# EAGLE design LE1-11 (EAGLE 8.5.2)
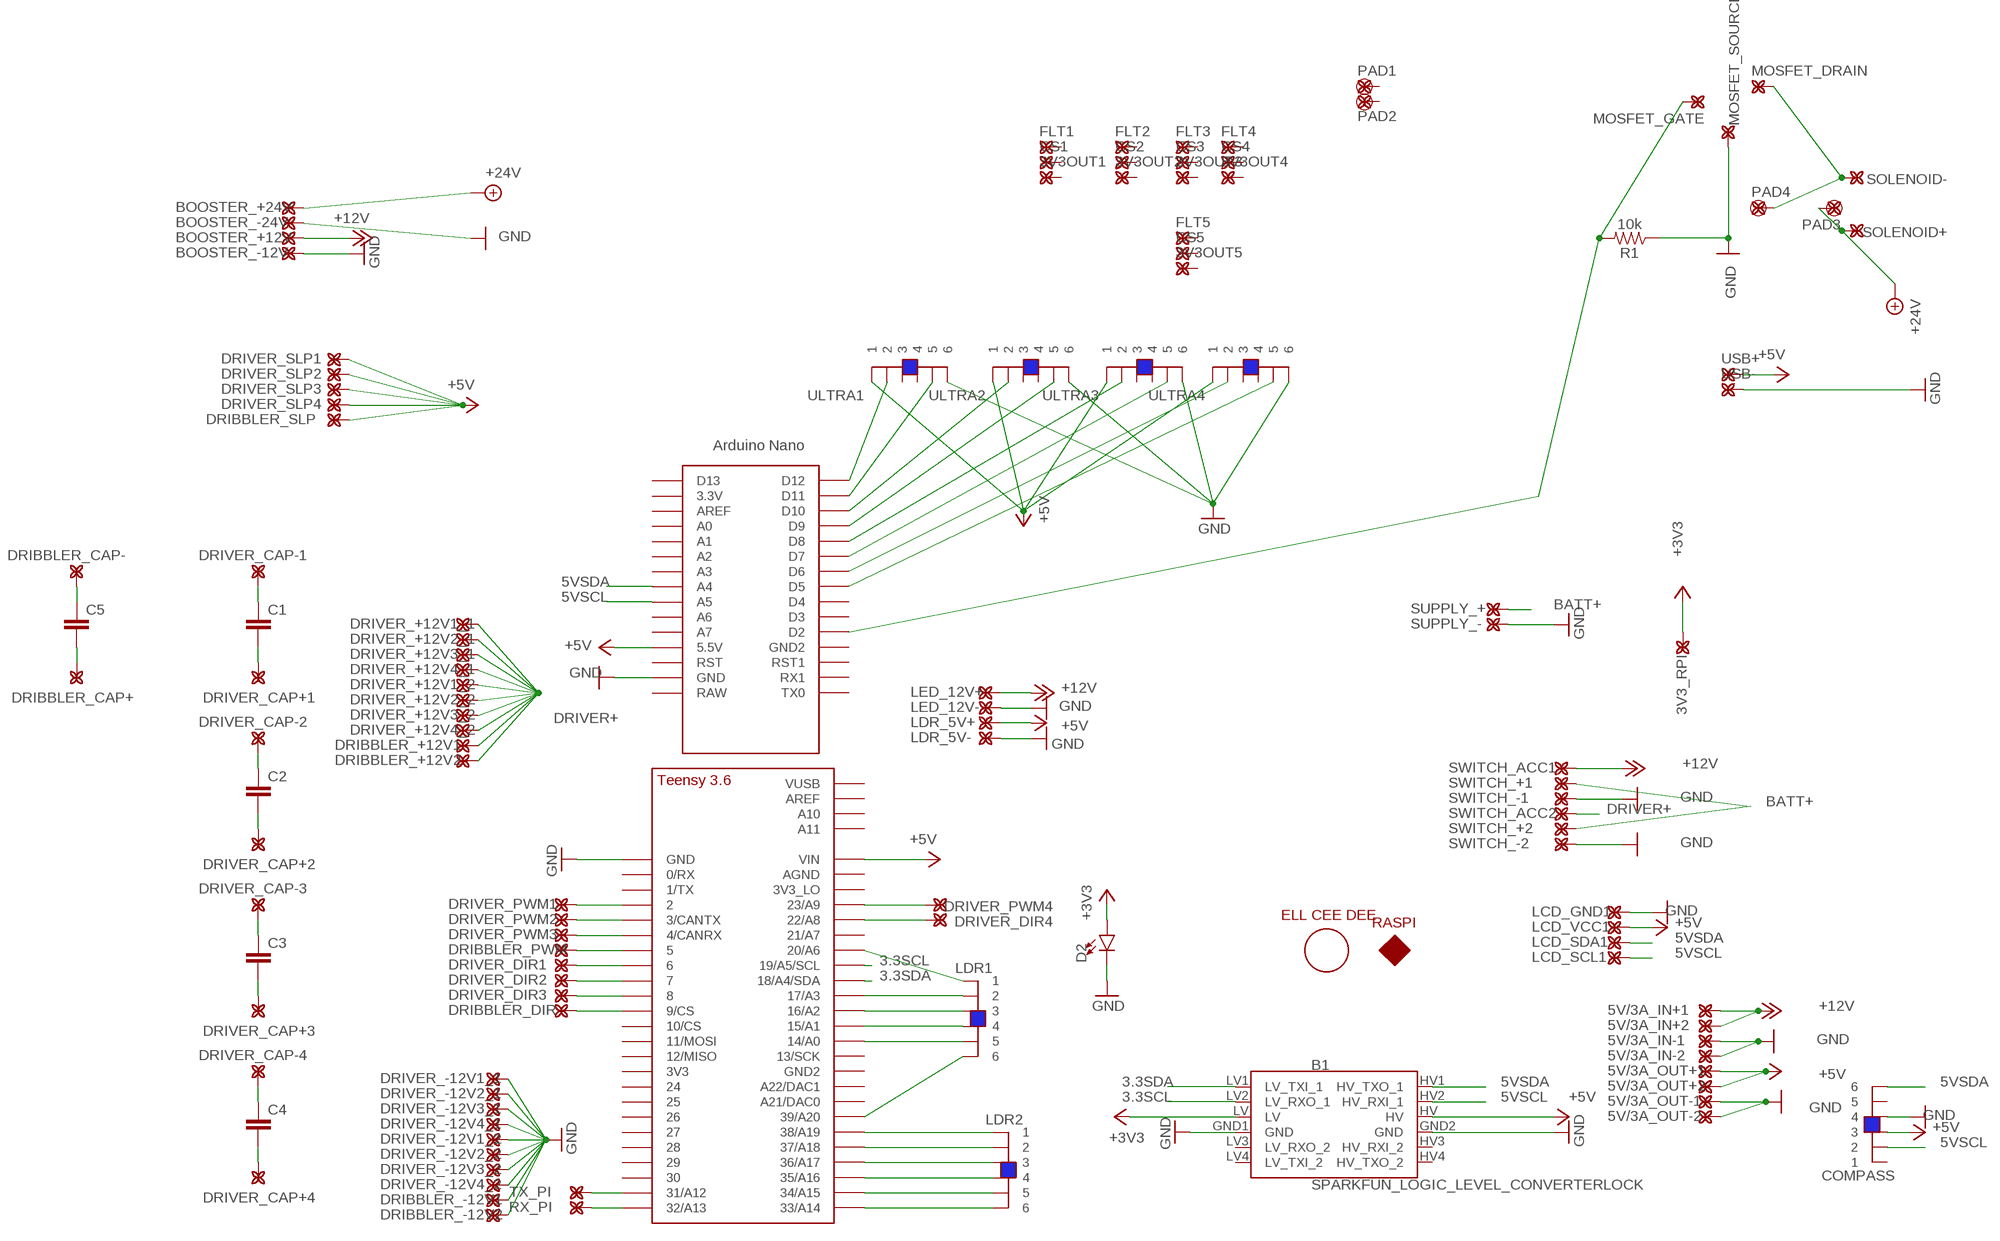
[diagram p0: schematic, sheet 1]

## Parts
3V3_RPI  BETTERPAD_2.54  [SUPERIORSIM]
3V3OUT1  BETTERPAD_2.54  [SUPERIORSIM]
3V3OUT2  BETTERPAD_2.54  [SUPERIORSIM]
3V3OUT3  BETTERPAD_2.54  [SUPERIORSIM]
3V3OUT4  BETTERPAD_2.54  [SUPERIORSIM]
3V3OUT5  BETTERPAD_2.54  [SUPERIORSIM]
5V/3A_IN+1  BETTERPAD_2.54  [SUPERIORSIM]
5V/3A_IN+2  BETTERPAD_2.54  [SUPERIORSIM]
5V/3A_IN-1  BETTERPAD_2.54  [SUPERIORSIM]
5V/3A_IN-2  BETTERPAD_2.54  [SUPERIORSIM]
5V/3A_OUT+1  BETTERPAD_2.54  [SUPERIORSIM]
5V/3A_OUT+2  BETTERPAD_2.54  [SUPERIORSIM]
5V/3A_OUT-1  BETTERPAD_2.54  [SUPERIORSIM]
5V/3A_OUT-2  BETTERPAD_2.54  [SUPERIORSIM]
B1  SPARKFUN_LOGIC_LEVEL_CONVERTERLOCK  [SPARKFUN_LOGIC_LEVEL_CONVERTER_LOCK]
BOOSTER_+12V  BETTERPAD_2.54  [SUPERIORSIM]
BOOSTER_+24V  BETTERPAD_2.54  [SUPERIORSIM]
BOOSTER_-12V  BETTERPAD_2.54  [SUPERIORSIM]
BOOSTER_-24V  BETTERPAD_2.54  [SUPERIORSIM]
C1  C5/7.2  [C5B7.2]
C2  C5/7.2  [C5B7.2]
C3  C5/7.2  [C5B7.2]
C4  C5/7.2  [C5B7.2]
C5  C5/7.2  [C5B7.2]
COMPASS  6P6C_FEMALESMD  [6P6C_FEMALE]
CS1  BETTERPAD_2.54  [SUPERIORSIM]
CS2  BETTERPAD_2.54  [SUPERIORSIM]
CS3  BETTERPAD_2.54  [SUPERIORSIM]
CS4  BETTERPAD_2.54  [SUPERIORSIM]
CS5  BETTERPAD_2.54  [SUPERIORSIM]
D2  LED-3MM-NO_SILK  [LED_3MM-NS]
DRIBBLER_+12V1  BETTERPAD_2.54  [SUPERIORSIM]
DRIBBLER_+12V2  BETTERPAD_2.54  [SUPERIORSIM]
DRIBBLER_-12V1  BETTERPAD_2.54  [SUPERIORSIM]
DRIBBLER_-12V2  BETTERPAD_2.54  [SUPERIORSIM]
DRIBBLER_CAP+  BETTERPAD_2.54  [SUPERIORSIM]
DRIBBLER_CAP-  BETTERPAD_2.54  [SUPERIORSIM]
DRIBBLER_DIR  BETTERPAD_2.54  [SUPERIORSIM]
DRIBBLER_PWM  BETTERPAD_2.54  [SUPERIORSIM]
DRIBBLER_SLP  BETTERPAD_2.54  [SUPERIORSIM]
DRIVER_+12V1_1  BETTERPAD_2.54  [SUPERIORSIM]
DRIVER_+12V1_2  BETTERPAD_2.54  [SUPERIORSIM]
DRIVER_+12V2_1  BETTERPAD_2.54  [SUPERIORSIM]
DRIVER_+12V2_2  BETTERPAD_2.54  [SUPERIORSIM]
DRIVER_+12V3_1  BETTERPAD_2.54  [SUPERIORSIM]
DRIVER_+12V3_2  BETTERPAD_2.54  [SUPERIORSIM]
DRIVER_+12V4_1  BETTERPAD_2.54  [SUPERIORSIM]
DRIVER_+12V4_2  BETTERPAD_2.54  [SUPERIORSIM]
DRIVER_-12V1_1  BETTERPAD_2.54  [SUPERIORSIM]
DRIVER_-12V1_2  BETTERPAD_2.54  [SUPERIORSIM]
DRIVER_-12V2_1  BETTERPAD_2.54  [SUPERIORSIM]
DRIVER_-12V2_2  BETTERPAD_2.54  [SUPERIORSIM]
DRIVER_-12V3_1  BETTERPAD_2.54  [SUPERIORSIM]
DRIVER_-12V3_2  BETTERPAD_2.54  [SUPERIORSIM]
DRIVER_-12V4_1  BETTERPAD_2.54  [SUPERIORSIM]
DRIVER_-12V4_2  BETTERPAD_2.54  [SUPERIORSIM]
DRIVER_CAP+1  BETTERPAD_2.54  [SUPERIORSIM]
DRIVER_CAP+2  BETTERPAD_2.54  [SUPERIORSIM]
DRIVER_CAP+3  BETTERPAD_2.54  [SUPERIORSIM]
DRIVER_CAP+4  BETTERPAD_2.54  [SUPERIORSIM]
DRIVER_CAP-1  BETTERPAD_2.54  [SUPERIORSIM]
DRIVER_CAP-2  BETTERPAD_2.54  [SUPERIORSIM]
DRIVER_CAP-3  BETTERPAD_2.54  [SUPERIORSIM]
DRIVER_CAP-4  BETTERPAD_2.54  [SUPERIORSIM]
DRIVER_DIR1  BETTERPAD_2.54  [SUPERIORSIM]
DRIVER_DIR2  BETTERPAD_2.54  [SUPERIORSIM]
DRIVER_DIR3  BETTERPAD_2.54  [SUPERIORSIM]
DRIVER_DIR4  BETTERPAD_2.54  [SUPERIORSIM]
DRIVER_PWM1  BETTERPAD_2.54  [SUPERIORSIM]
DRIVER_PWM2  BETTERPAD_2.54  [SUPERIORSIM]
DRIVER_PWM3  BETTERPAD_2.54  [SUPERIORSIM]
DRIVER_PWM4  BETTERPAD_2.54  [SUPERIORSIM]
DRIVER_SLP1  BETTERPAD_2.54  [SUPERIORSIM]
DRIVER_SLP2  BETTERPAD_2.54  [SUPERIORSIM]
DRIVER_SLP3  BETTERPAD_2.54  [SUPERIORSIM]
DRIVER_SLP4  BETTERPAD_2.54  [SUPERIORSIM]
FLT1  BETTERPAD_2.54  [SUPERIORSIM]
FLT2  BETTERPAD_2.54  [SUPERIORSIM]
FLT3  BETTERPAD_2.54  [SUPERIORSIM]
FLT4  BETTERPAD_2.54  [SUPERIORSIM]
FLT5  BETTERPAD_2.54  [SUPERIORSIM]
LCD1  LCD-16X2SILK  [LCD-16X2]
LCD_GND1  BETTERPAD_2.54  [SUPERIORSIM]
LCD_SCL1  BETTERPAD_2.54  [SUPERIORSIM]
LCD_SDA1  BETTERPAD_2.54  [SUPERIORSIM]
LCD_VCC1  BETTERPAD_2.54  [SUPERIORSIM]
LDR1  6P6C_FEMALESMD  [6P6C_FEMALE]
LDR2  6P6C_FEMALESMD  [6P6C_FEMALE]
LDR_5V+  BETTERPAD_2.54  [SUPERIORSIM]
LDR_5V-  BETTERPAD_2.54  [SUPERIORSIM]
LED_12V+  BETTERPAD_2.54  [SUPERIORSIM]
LED_12V-  BETTERPAD_2.54  [SUPERIORSIM]
MOSFET_DRAIN  BETTERPAD_2.54  [SUPERIORSIM]
MOSFET_GATE  BETTERPAD_2.54  [SUPERIORSIM]
MOSFET_SOURCE  BETTERPAD_2.54  [SUPERIORSIM]
PAD1  BETTERPAD_2.54/1.5  [1,5]
PAD2  BETTERPAD_2.54/1.5  [1,5]
PAD3  BETTERPAD_2.54/1.5  [1,5]
PAD4  BETTERPAD_2.54/1.5  [1,5]
PCB1  RPI3  [RPI3]
R1  10k  10KOHM-HORIZ-1/4W-1%  [AXIAL-0.3]
RX_PI  BETTERPAD_2.54  [SUPERIORSIM]
SOLENOID+  BETTERPAD_2.54  [SUPERIORSIM]
SOLENOID-  BETTERPAD_2.54  [SUPERIORSIM]
SUPPLY_+  BETTERPAD_2.54  [SUPERIORSIM]
SUPPLY_-  BETTERPAD_2.54  [SUPERIORSIM]
SWITCH_+1  BETTERPAD_2.54  [SUPERIORSIM]
SWITCH_+2  BETTERPAD_2.54  [SUPERIORSIM]
SWITCH_-1  BETTERPAD_2.54  [SUPERIORSIM]
SWITCH_-2  BETTERPAD_2.54  [SUPERIORSIM]
SWITCH_ACC1  BETTERPAD_2.54  [SUPERIORSIM]
SWITCH_ACC2  BETTERPAD_2.54  [SUPERIORSIM]
TX_PI  BETTERPAD_2.54  [SUPERIORSIM]
U$1  TEENSY_3.5/3.6_BASIC  [TEENSY_3.5/3.6_BASIC]
U$2  NANO  [NANO]
ULTRA1  6P6C_FEMALESMD  [6P6C_FEMALE]
ULTRA2  6P6C_FEMALESMD  [6P6C_FEMALE]
ULTRA3  6P6C_FEMALESMD  [6P6C_FEMALE]
ULTRA4  6P6C_FEMALESMD  [6P6C_FEMALE]
USB+  BETTERPAD_2.54  [SUPERIORSIM]
USB-  BETTERPAD_2.54  [SUPERIORSIM]

## Nets
3.3SCL: B1.LV2(LV_RXO_1) U$1.19/A5/SCL
3.3SDA: B1.LV1(LV_TXI_1) U$1.18/A4/SDA
5VSCL: B1.HV2(HV_RXI_1) COMPASS.2 LCD_SCL1..(P) U$2.A5
5VSDA: B1.HV1(HV_TXO_1) COMPASS.6 LCD_SDA1..(P) U$2.A4
+3V3: 3V3_RPI..(P) B1.LV D2.A
+5V: 5V/3A_OUT+1..(P) 5V/3A_OUT+2..(P) B1.HV COMPASS.3 DRIBBLER_SLP..(P) DRIVER_SLP1..(P) DRIVER_SLP2..(P) DRIVER_SLP3..(P) DRIVER_SLP4..(P) LCD_VCC1..(P) LDR_5V+..(P) U$1.VIN U$2.5V(5.5V) ULTRA1.1 ULTRA2.1 ULTRA3.1 ULTRA4.1 USB+..(P)
+12V: 5V/3A_IN+1..(P) 5V/3A_IN+2..(P) BOOSTER_+12V..(P) LED_12V+..(P) SWITCH_ACC1..(P)
+24V: BOOSTER_+24V..(P) PAD3.P$1(P) SOLENOID+..(P)
BATT+: SUPPLY_+..(P) SWITCH_+1..(P) SWITCH_+2..(P)
DRIVER+: DRIBBLER_+12V1..(P) DRIBBLER_+12V2..(P) DRIVER_+12V1_1..(P) DRIVER_+12V1_2..(P) DRIVER_+12V2_1..(P) DRIVER_+12V2_2..(P) DRIVER_+12V3_1..(P) DRIVER_+12V3_2..(P) DRIVER_+12V4_1..(P) DRIVER_+12V4_2..(P) SWITCH_ACC2..(P)
GND: 5V/3A_IN-1..(P) 5V/3A_IN-2..(P) 5V/3A_OUT-1..(P) 5V/3A_OUT-2..(P) B1.GND1(GND) B1.GND2(GND) BOOSTER_-12V..(P) BOOSTER_-24V..(P) COMPASS.4 D2.K(C) DRIBBLER_-12V1..(P) DRIBBLER_-12V2..(P) DRIVER_-12V1_1..(P) DRIVER_-12V1_2..(P) DRIVER_-12V2_1..(P) DRIVER_-12V2_2..(P) DRIVER_-12V3_1..(P) DRIVER_-12V3_2..(P) DRIVER_-12V4_1..(P) DRIVER_-12V4_2..(P) LCD_GND1..(P) LDR_5V-..(P) LED_12V-..(P) MOSFET_SOURCE..(P) R1.P$1 SUPPLY_-..(P) SWITCH_-1..(P) SWITCH_-2..(P) U$1.GND U$2.GND ULTRA1.6 ULTRA2.6 ULTRA3.6 ULTRA4.6 USB-..(P)
N$1: LDR1.6 U$1.39/A20
N$2: TX_PI..(P) U$1.31/A12
N$3: RX_PI..(P) U$1.32/A13
N$4: DRIBBLER_DIR..(P) U$1.9/CS
N$5: DRIVER_DIR3..(P) U$1.8
N$6: LDR1.5 U$1.14/A0
N$7: LDR1.4 U$1.15/A1
N$8: LDR1.3 U$1.16/A2
N$9: LDR1.2 U$1.17/A3
N$10: LDR1.1 U$1.20/A6
N$11: DRIVER_DIR2..(P) U$1.7
N$12: MOSFET_DRAIN..(P) PAD4.P$1(P) SOLENOID-..(P)
N$14: DRIVER_PWM4..(P) U$1.23/A9
N$15: DRIVER_DIR4..(P) U$1.22/A8
N$16: C4.2 DRIVER_CAP+4..(P)
N$17: DRIVER_DIR1..(P) U$1.6
N$18: LDR2.1 U$1.38/A19
N$19: LDR2.2 U$1.37/A18
N$20: LDR2.3 U$1.36/A17
N$21: LDR2.4 U$1.35/A16
N$22: LDR2.5 U$1.34/A15
N$23: LDR2.6 U$1.33/A14
N$24: DRIBBLER_PWM..(P) U$1.5
N$25: DRIVER_PWM3..(P) U$1.4/CANRX
N$26: U$2.D12 ULTRA1.2
N$27: C4.1 DRIVER_CAP-4..(P)
N$28: U$2.D11 ULTRA1.5
N$29: U$2.D10 ULTRA2.2
N$30: U$2.D9 ULTRA2.5
N$31: C3.2 DRIVER_CAP+3..(P)
N$32: C3.1 DRIVER_CAP-3..(P)
N$33: C2.2 DRIVER_CAP+2..(P)
N$34: C2.1 DRIVER_CAP-2..(P)
N$35: C1.2 DRIVER_CAP+1..(P)
N$36: C1.1 DRIVER_CAP-1..(P)
N$37: C5.1 DRIBBLER_CAP-..(P)
N$38: C5.2 DRIBBLER_CAP+..(P)
N$39: U$2.D8 ULTRA3.2
N$40: U$2.D7 ULTRA3.5
N$41: U$2.D6 ULTRA4.2
N$42: U$2.D5 ULTRA4.5
N$43: DRIVER_PWM2..(P) U$1.3/CANTX
N$44: DRIVER_PWM1..(P) U$1.2
N$45: MOSFET_GATE..(P) R1.P$2 U$2.D2
Unconnected: 3V3OUT1..(P) 3V3OUT2..(P) 3V3OUT3..(P) 3V3OUT4..(P) 3V3OUT5..(P) B1.HV3(HV_RXI_2) B1.HV4(HV_TXO_2) B1.LV3(LV_RXO_2) B1.LV4(LV_TXI_2) COMPASS.1 COMPASS.5 CS1..(P) CS2..(P) CS3..(P) CS4..(P) CS5..(P) FLT1..(P) FLT2..(P) FLT3..(P) FLT4..(P) FLT5..(P) PAD1.P$1(P) PAD2.P$1(P) U$1.0/RX U$1.1/TX U$1.3V3 U$1.3V3_LO U$1.10/CS U$1.11/MOSI U$1.12/MISO U$1.13/SCK U$1.21/A7 U$1.21/DAC0(A21/DAC0) U$1.24 U$1.25 U$1.26 U$1.27 U$1.28 U$1.29 U$1.30 U$1.A10 U$1.A11 U$1.A22/DAC1 U$1.AGND U$1.AREF U$1.GND2 U$1.VUSB U$2.3.3V U$2.A0 U$2.A1 U$2.A2 U$2.A3 U$2.A6 U$2.A7 U$2.AREF U$2.D3 U$2.D4 U$2.D13 U$2.GND1(GND2) U$2.RAW U$2.RST U$2.RST1 U$2.RX1 U$2.TX0 ULTRA1.3 ULTRA1.4 ULTRA2.3 ULTRA2.4 ULTRA3.3 ULTRA3.4 ULTRA4.3 ULTRA4.4

## Library data of the parts
3V3_RPI 3V3OUT1-3V3OUT5 5V/3A_IN+1 5V/3A_IN+2 5V/3A_IN-1 5V/3A_IN-2 5V/3A_OUT+1 5V/3A_OUT+2 5V/3A_OUT-1 5V/3A_OUT-2 BOOSTER_+12V BOOSTER_+24V BOOSTER_-12V BOOSTER_-24V CS1-CS5 DRIBBLER_+12V1 DRIBBLER_+12V2 DRIBBLER_-12V1 DRIBBLER_-12V2 DRIBBLER_CAP+ DRIBBLER_CAP- DRIBBLER_DIR DRIBBLER_PWM DRIBBLER_SLP DRIVER_+12V1_1 DRIVER_+12V1_2 DRIVER_+12V2_1 DRIVER_+12V2_2 DRIVER_+12V3_1 DRIVER_+12V3_2 DRIVER_+12V4_1 DRIVER_+12V4_2 DRIVER_-12V1_1 DRIVER_-12V1_2 DRIVER_-12V2_1 DRIVER_-12V2_2 DRIVER_-12V3_1 DRIVER_-12V3_2 DRIVER_-12V4_1 DRIVER_-12V4_2 DRIVER_CAP+1-DRIVER_CAP+4 DRIVER_CAP-1-DRIVER_CAP-4 DRIVER_DIR1-DRIVER_DIR4 DRIVER_PWM1-DRIVER_PWM4 DRIVER_SLP1-DRIVER_SLP4 FLT1-FLT5 LCD_GND1 LCD_SCL1 LCD_SDA1 LCD_VCC1 LDR_5V+ LDR_5V- LED_12V+ LED_12V- MOSFET_DRAIN MOSFET_GATE MOSFET_SOURCE RX_PI SOLENOID+ SOLENOID- SUPPLY_+ SUPPLY_- SWITCH_+1 SWITCH_+2 SWITCH_-1 SWITCH_-2 SWITCH_ACC1 SWITCH_ACC2 TX_PI USB+ USB- = Yijiano:BETTERPAD_2.54
B1 = SparkFun-Boards:SPARKFUN_LOGIC_LEVEL_CONVERTER: SparkFun Logic Level Converter -Bi-Directional This is the mechnical outline for the 3.3V - 5V bi directional logic level converter. *Note, the "LOCK" Package has the header pins staggered by an offset of 5 mils (off center line), so that when you slide a row of standard 0.1" headers into the PTH pads, it will hold position vertically. See the follwing turorial for more information on this type of special footprints: Sneaky Footprints <https://www.sparkfun.com/tutorials/114> SparkFun Products: SparkFun Logic Level Converter - Bi-Directional <https://www.sparkfun.com/products/12009>
C1-C5 = capacitor-wima:C: CAPACITOR naming: grid - package width
COMPASS LDR1 LDR2 ULTRA1-ULTRA4 = Yijiano:6P6C_FEMALE
D2 = SparkFun-LED:LED: LED (Generic) Standard schematic elements and footprints for 5mm, 3mm, 1206, and 0603 sized LEDs. Generic LEDs with no color specified.
LCD1 = SparkFun-Displays:LCD-16X2: Standard text-only 16x2 parallel input LCD Basic 16 character by 2 line display. Typically utilizes the extremely common HD44780 parallel interface chipset SparkFun Products: Basic 16x2 Green <https://www.sparkfun.com/products/255> Basic 8x2 Green <https://www.sparkfun.com/products/11122>; SF_ID: LCD-00255
PAD1-PAD4 = Yijiano:BETTERPAD_2.54/1.5
PCB1 = e14_Rpi3_RevA:RPI3: Device for Raspberry Pi 3 board created by Dave Young for www.element14.com More information and support community is available at https://www.element14.com/community/community/raspberry-pi
R1 = SparkFun-Resistors:10KOHM: 10kΩ resistor A resistor is a passive two-terminal electrical component that implements electrical resistance as a circuit element. Resistors act to reduce current flow, and, at the same time, act to lower voltage levels within circuits. - Wikipedia; PROD_ID: RES-12183
U$1 = Teensy356:TEENSY_3.5/3.6_BASIC
U$2 = Arduino-clone:NANO: Arduino Nano

## Board
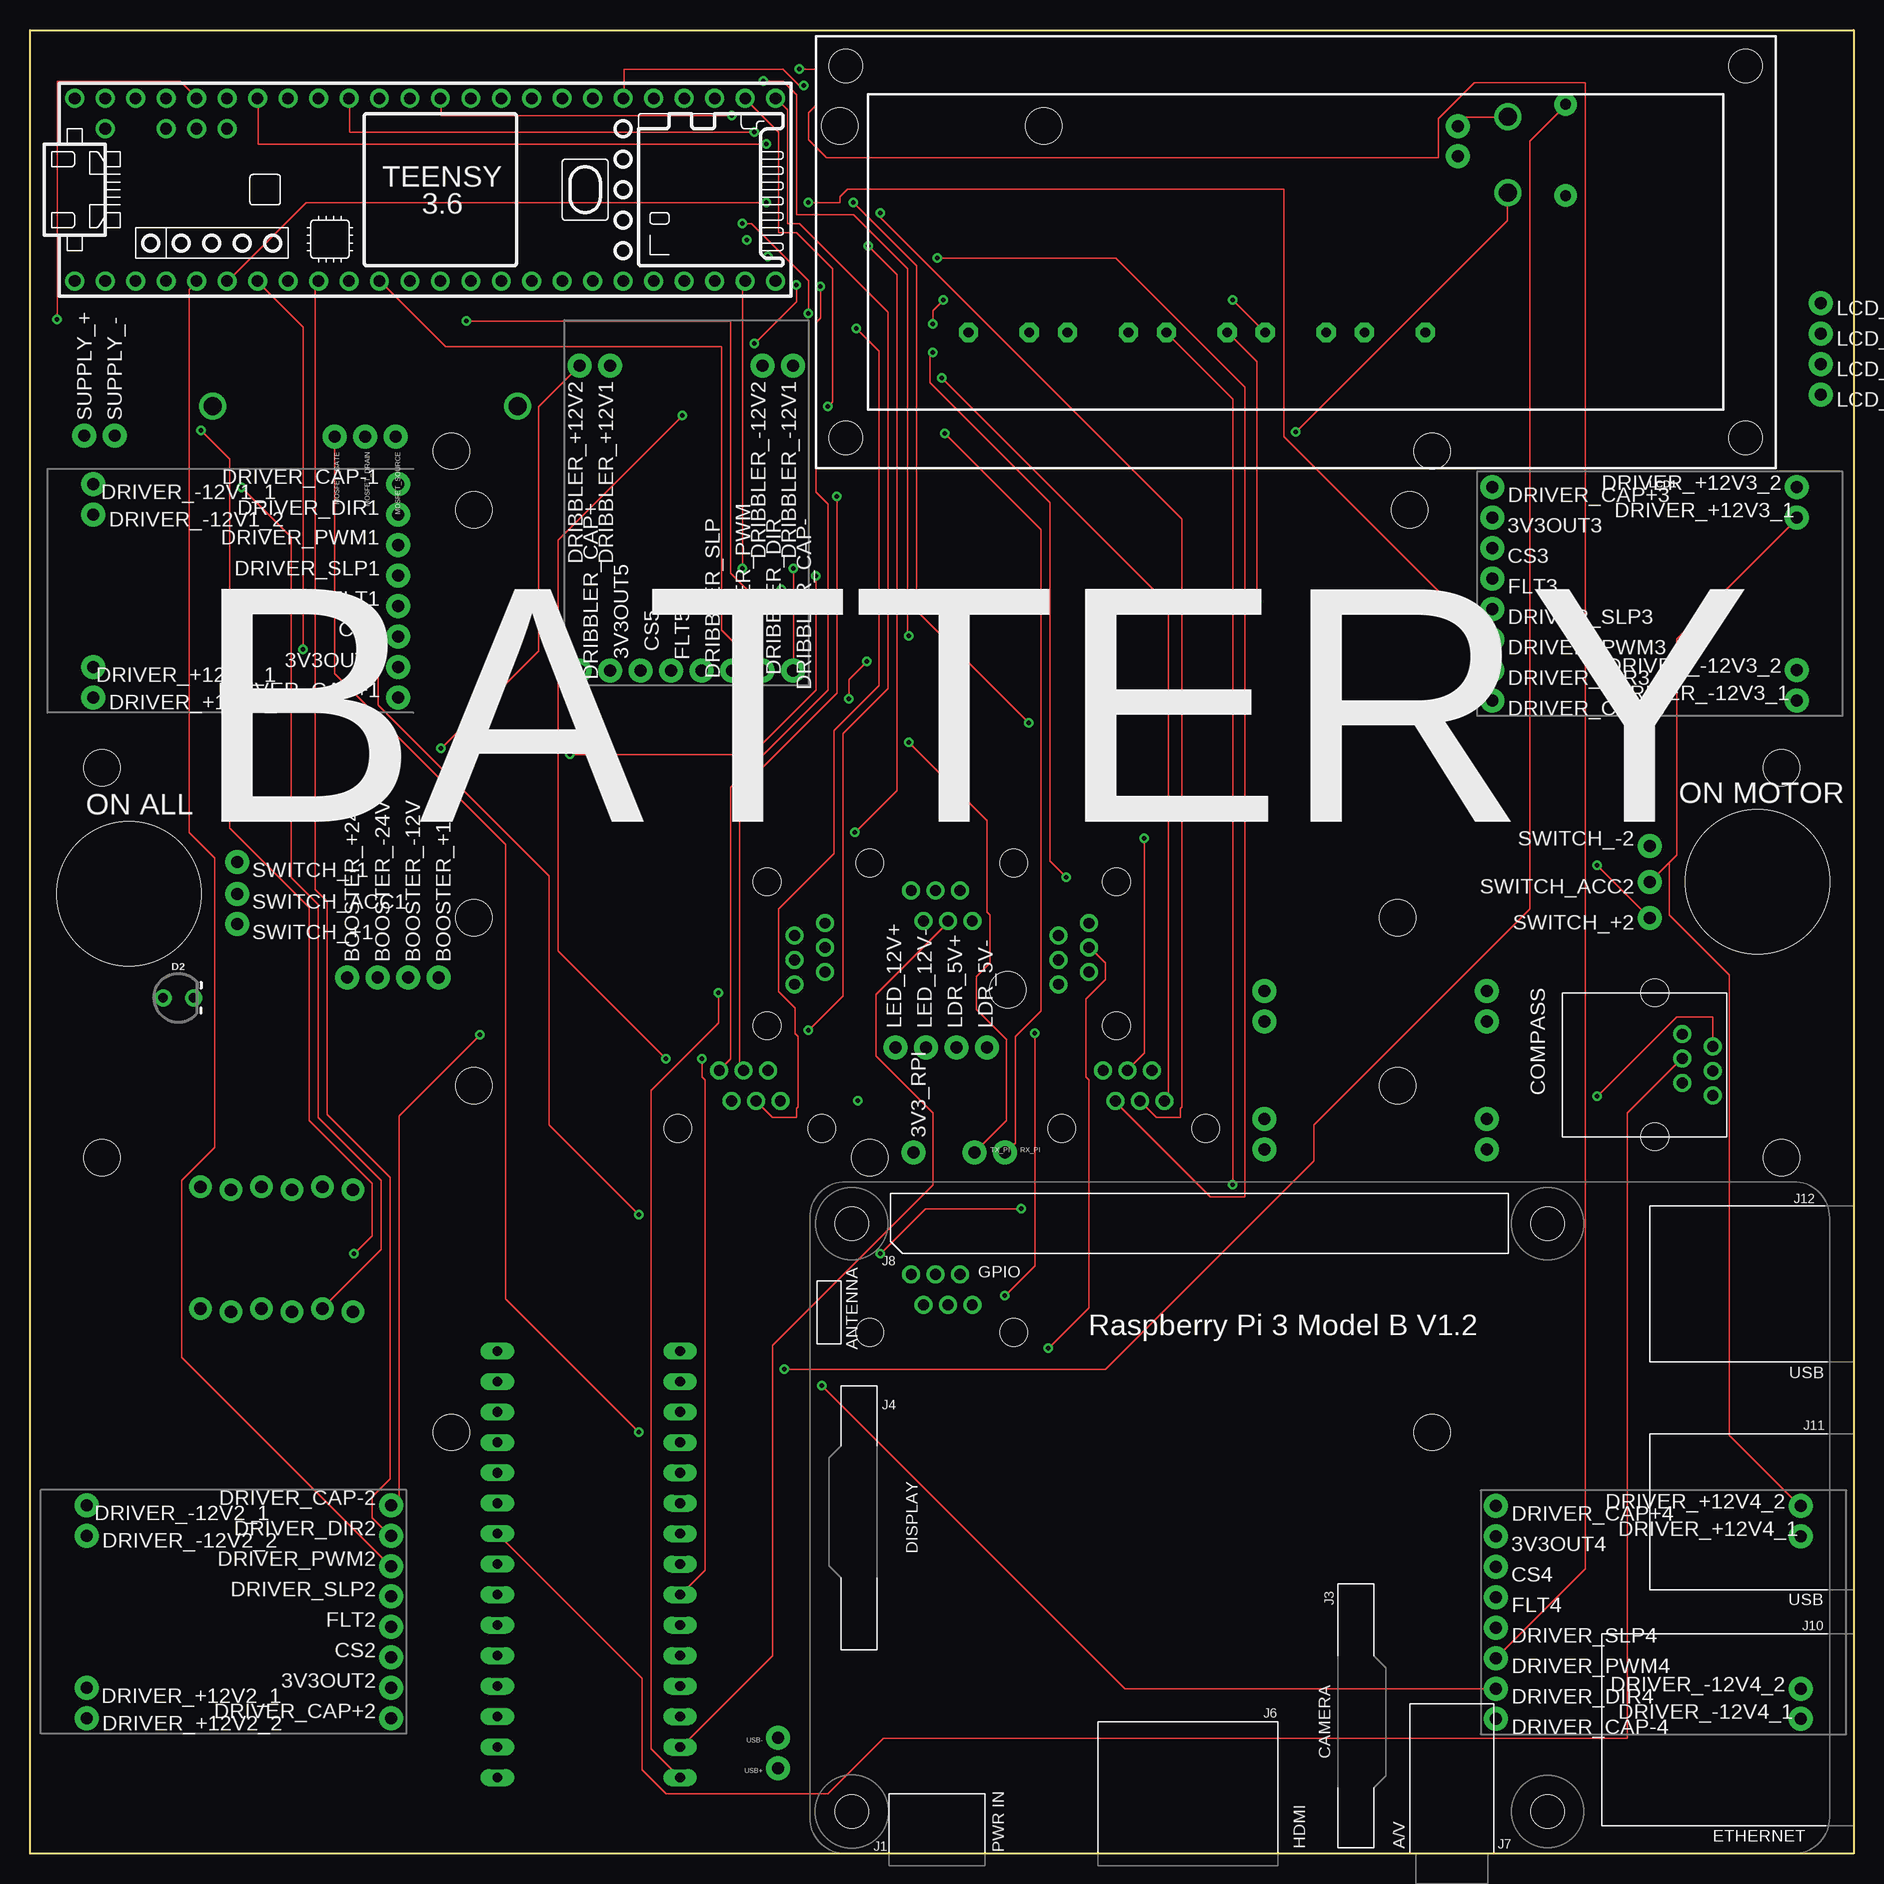
[diagram p1: board, top side]
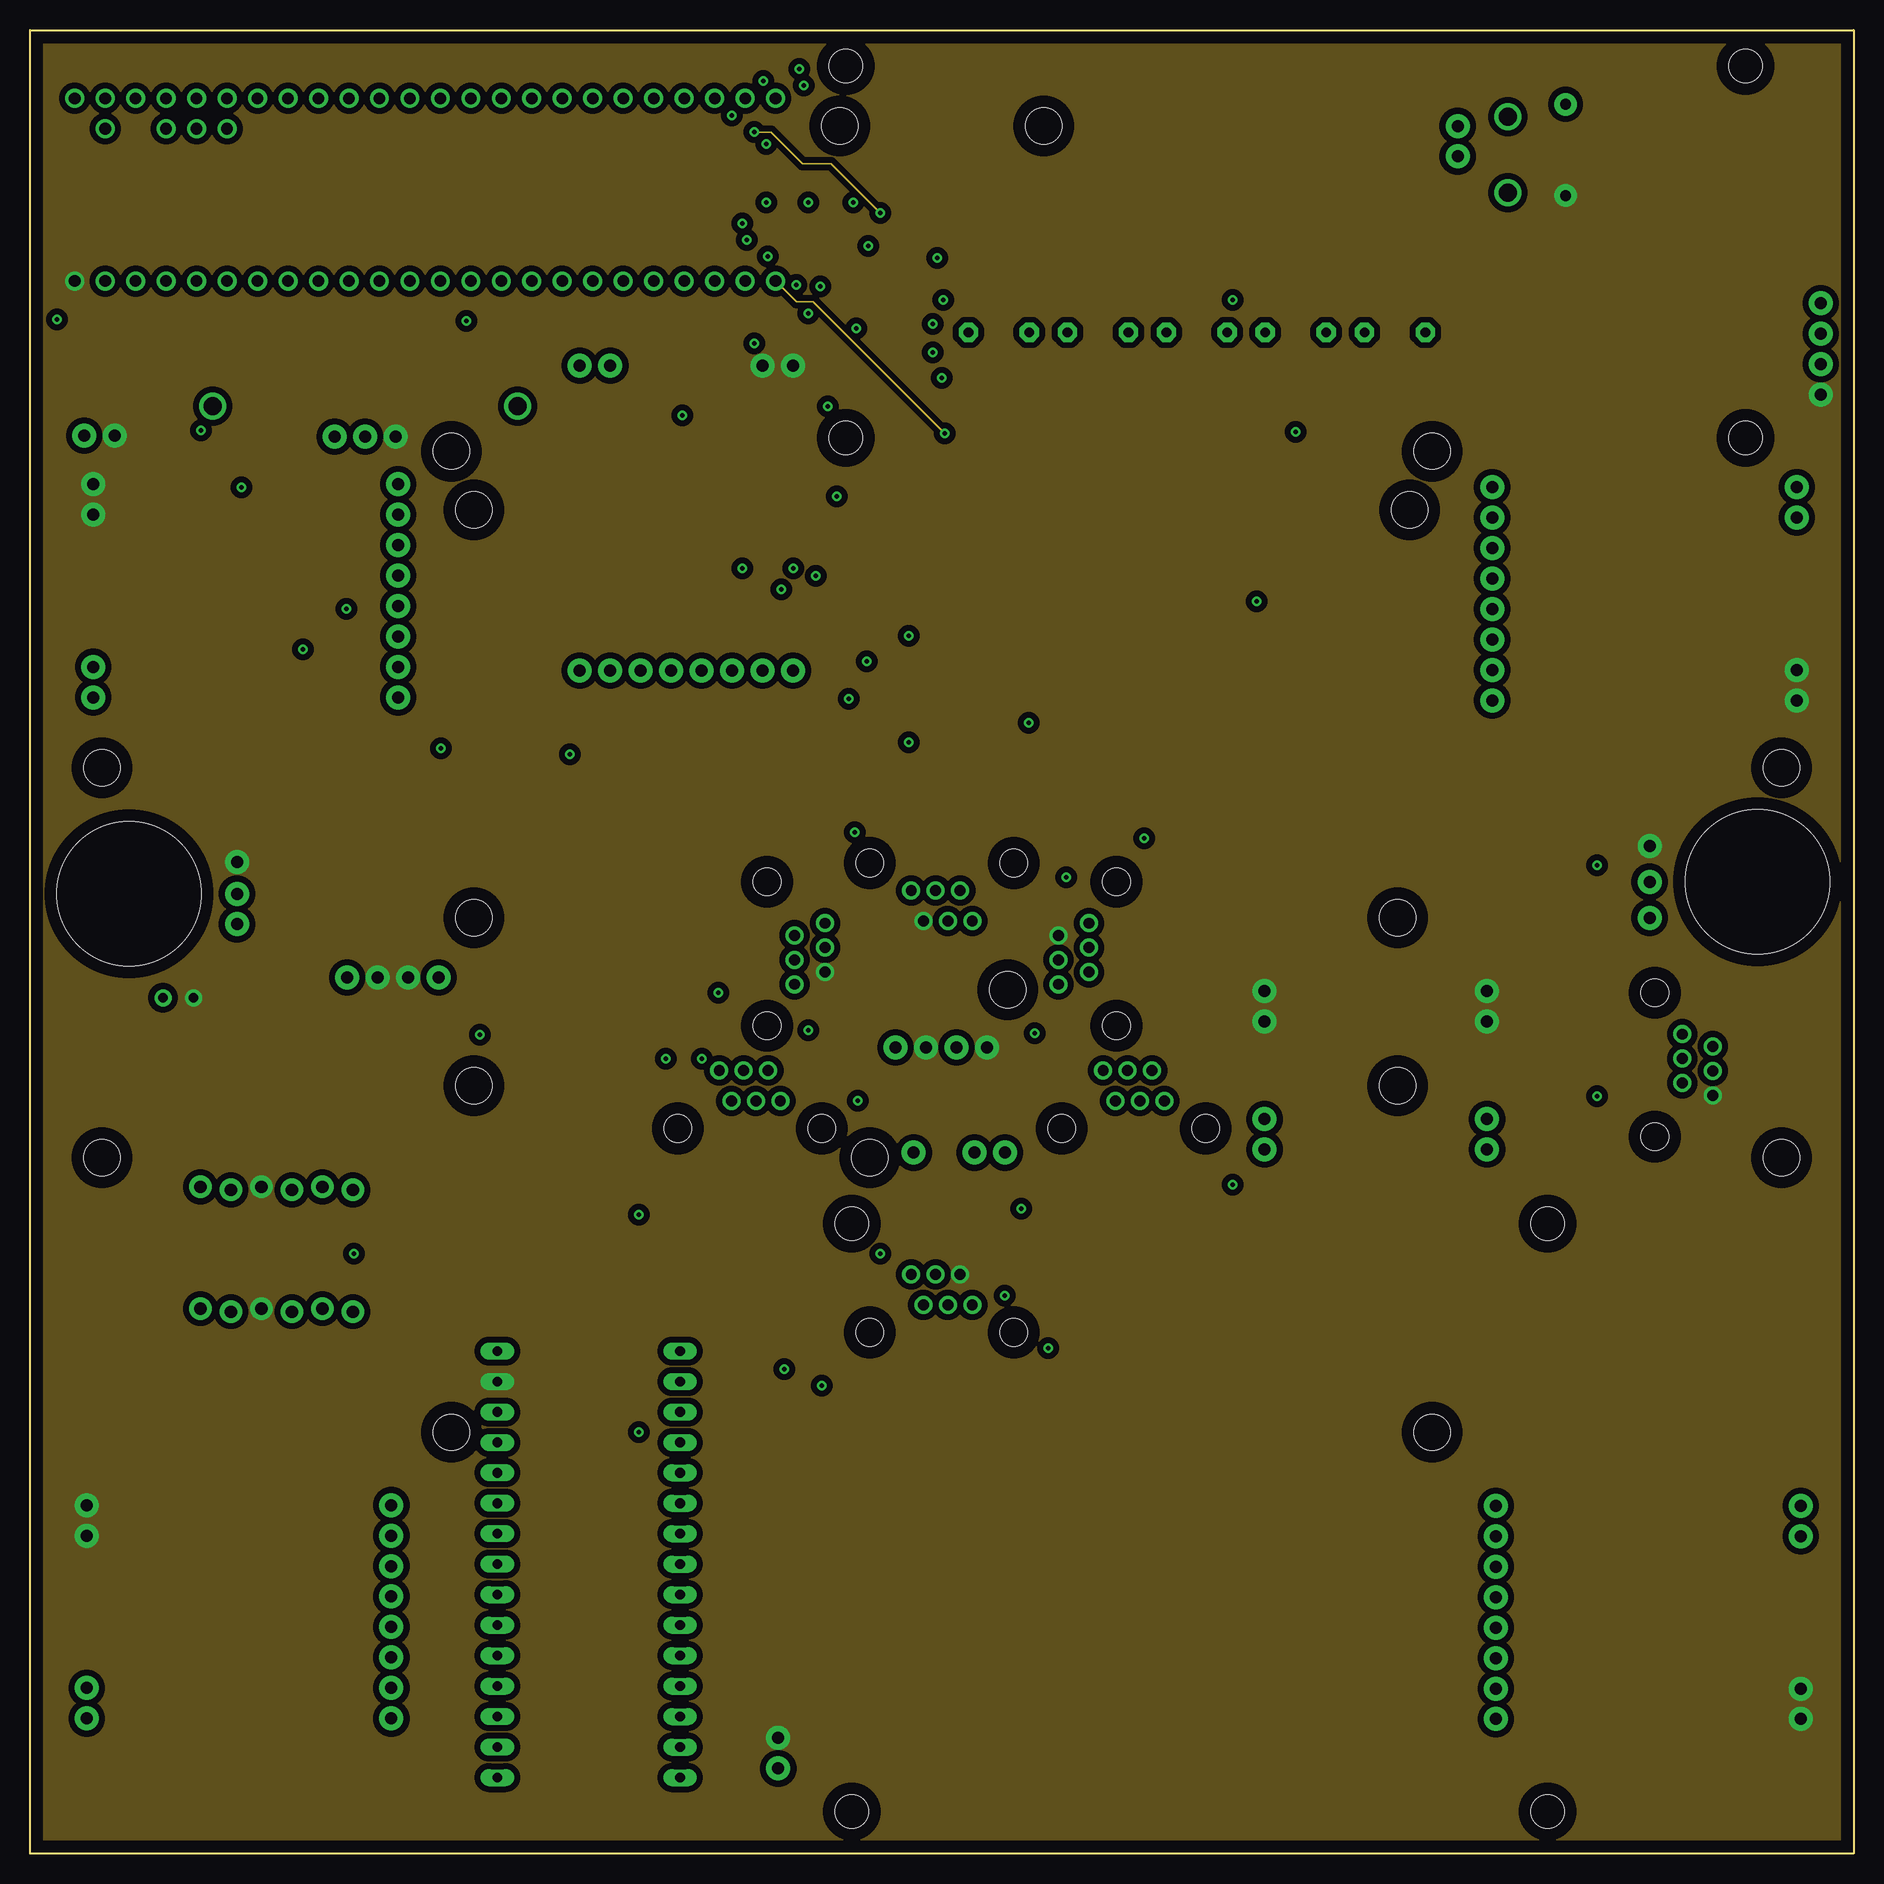
[diagram p2: board, inner layer Route2]
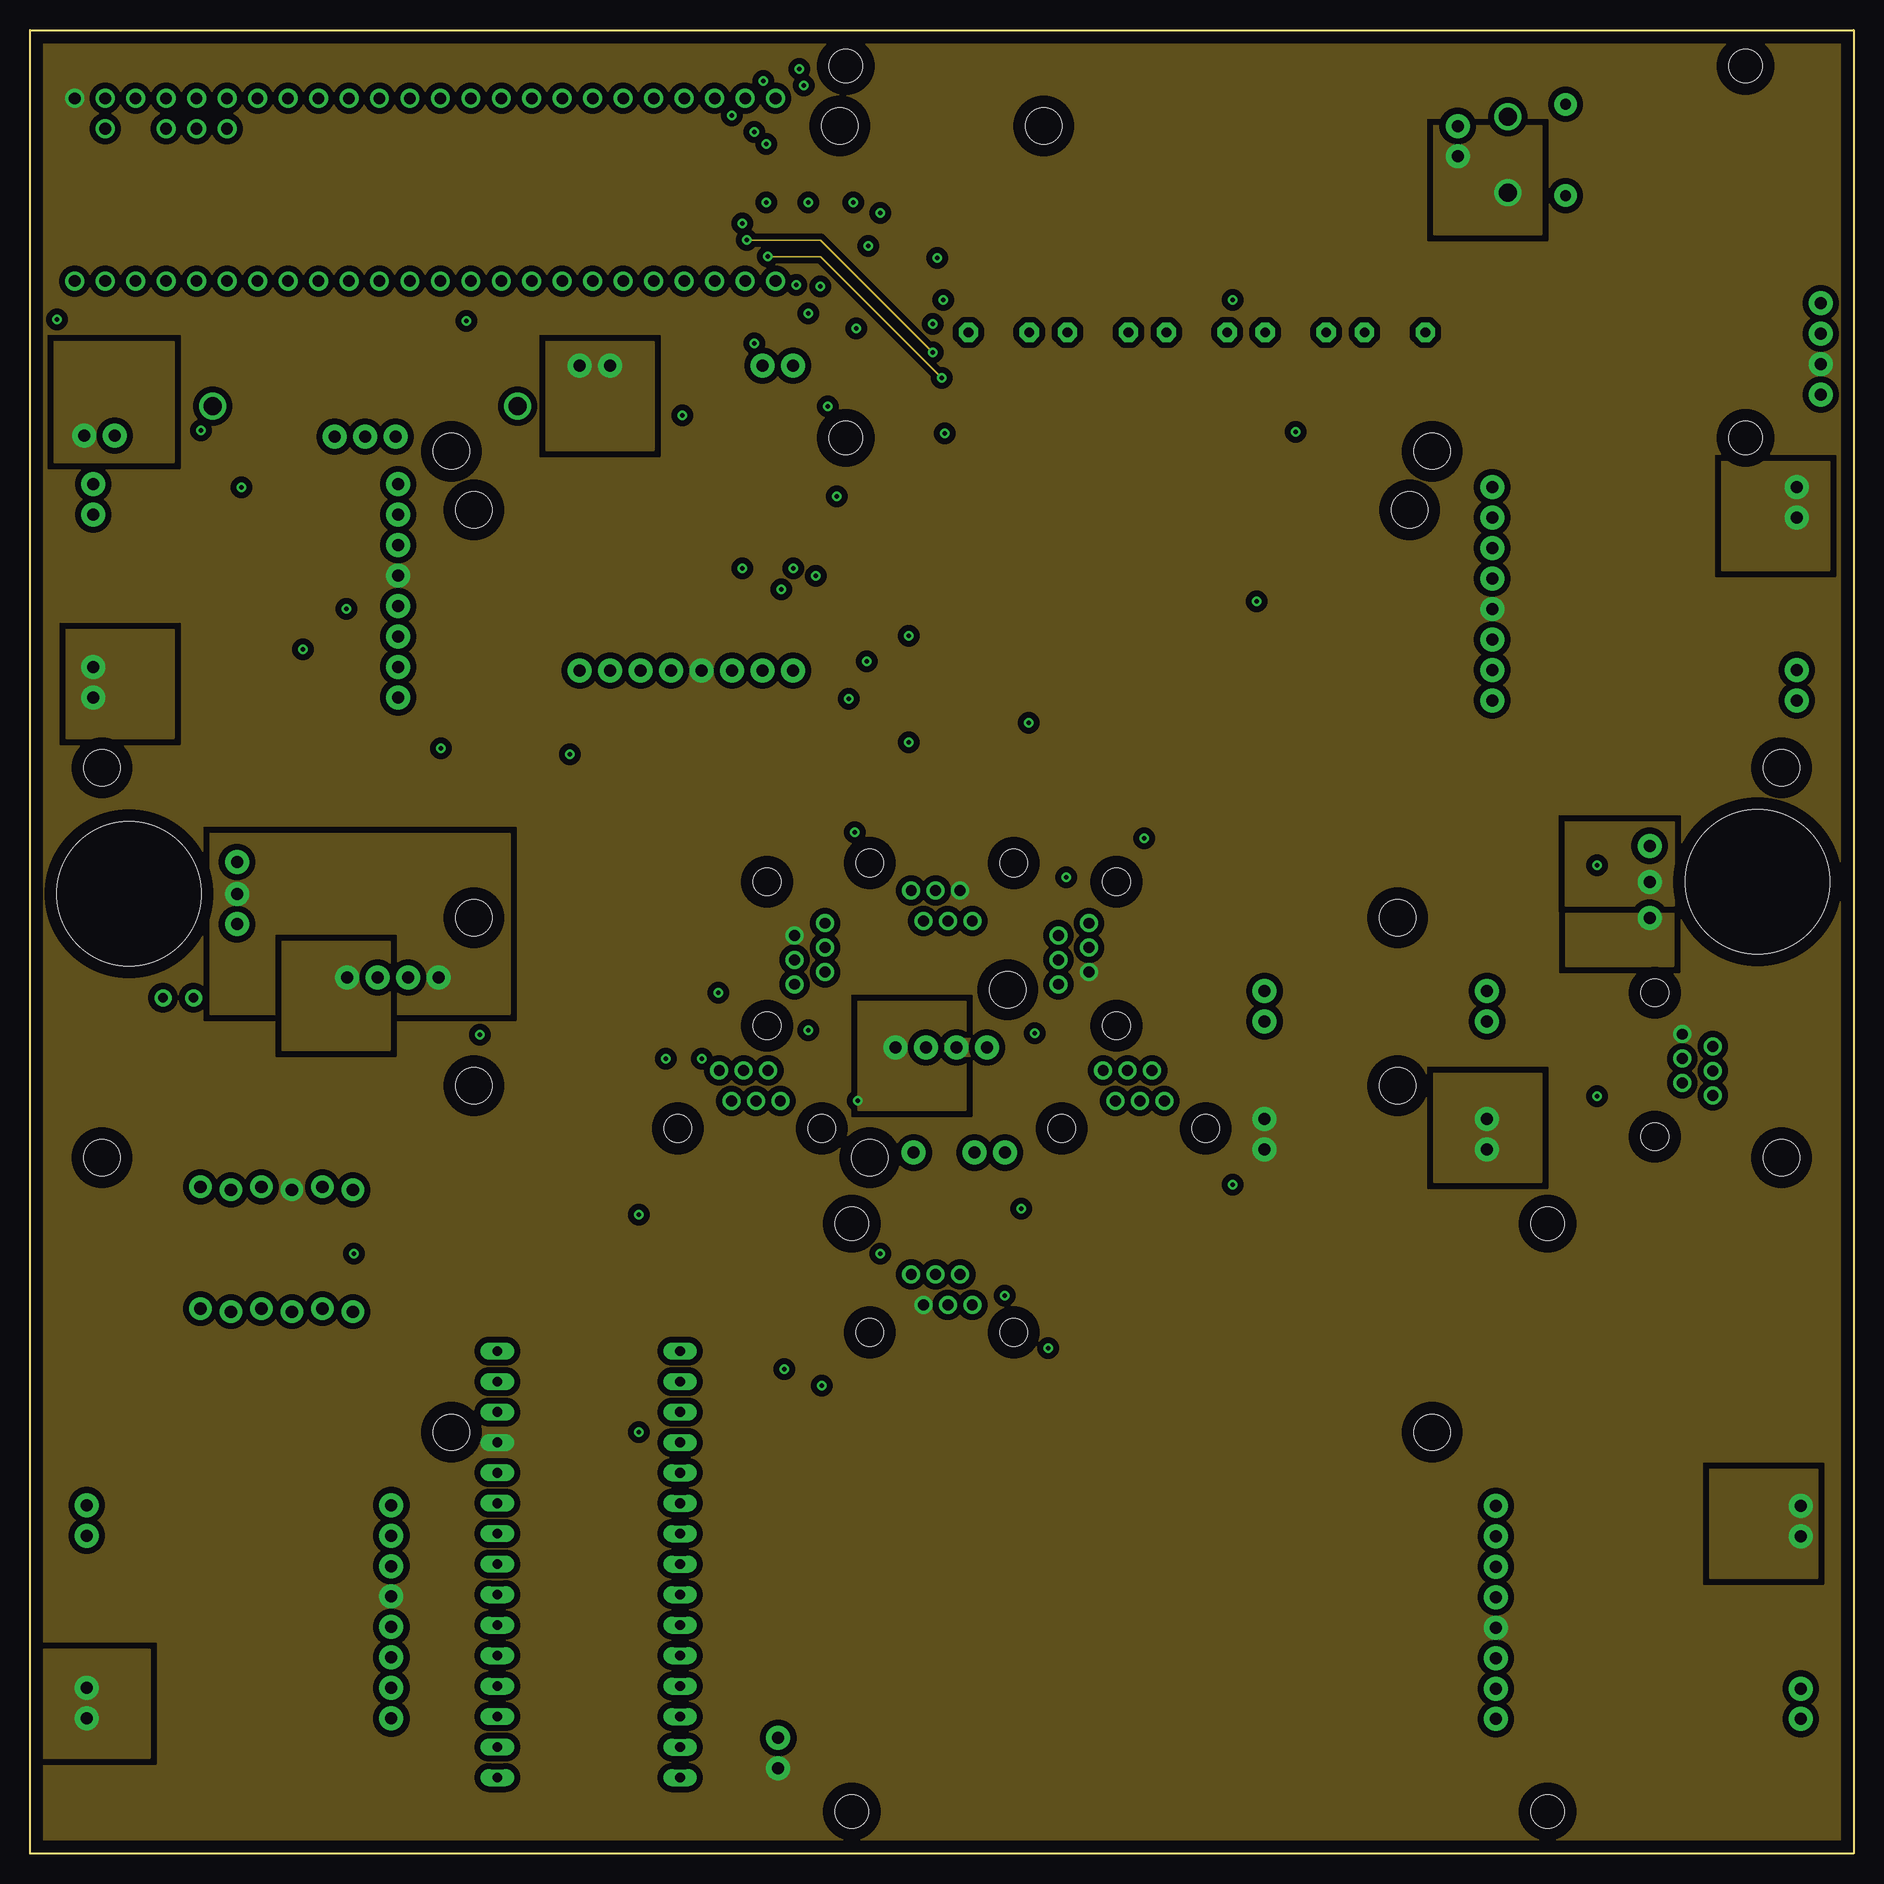
[diagram p3: board, inner layer Route3]
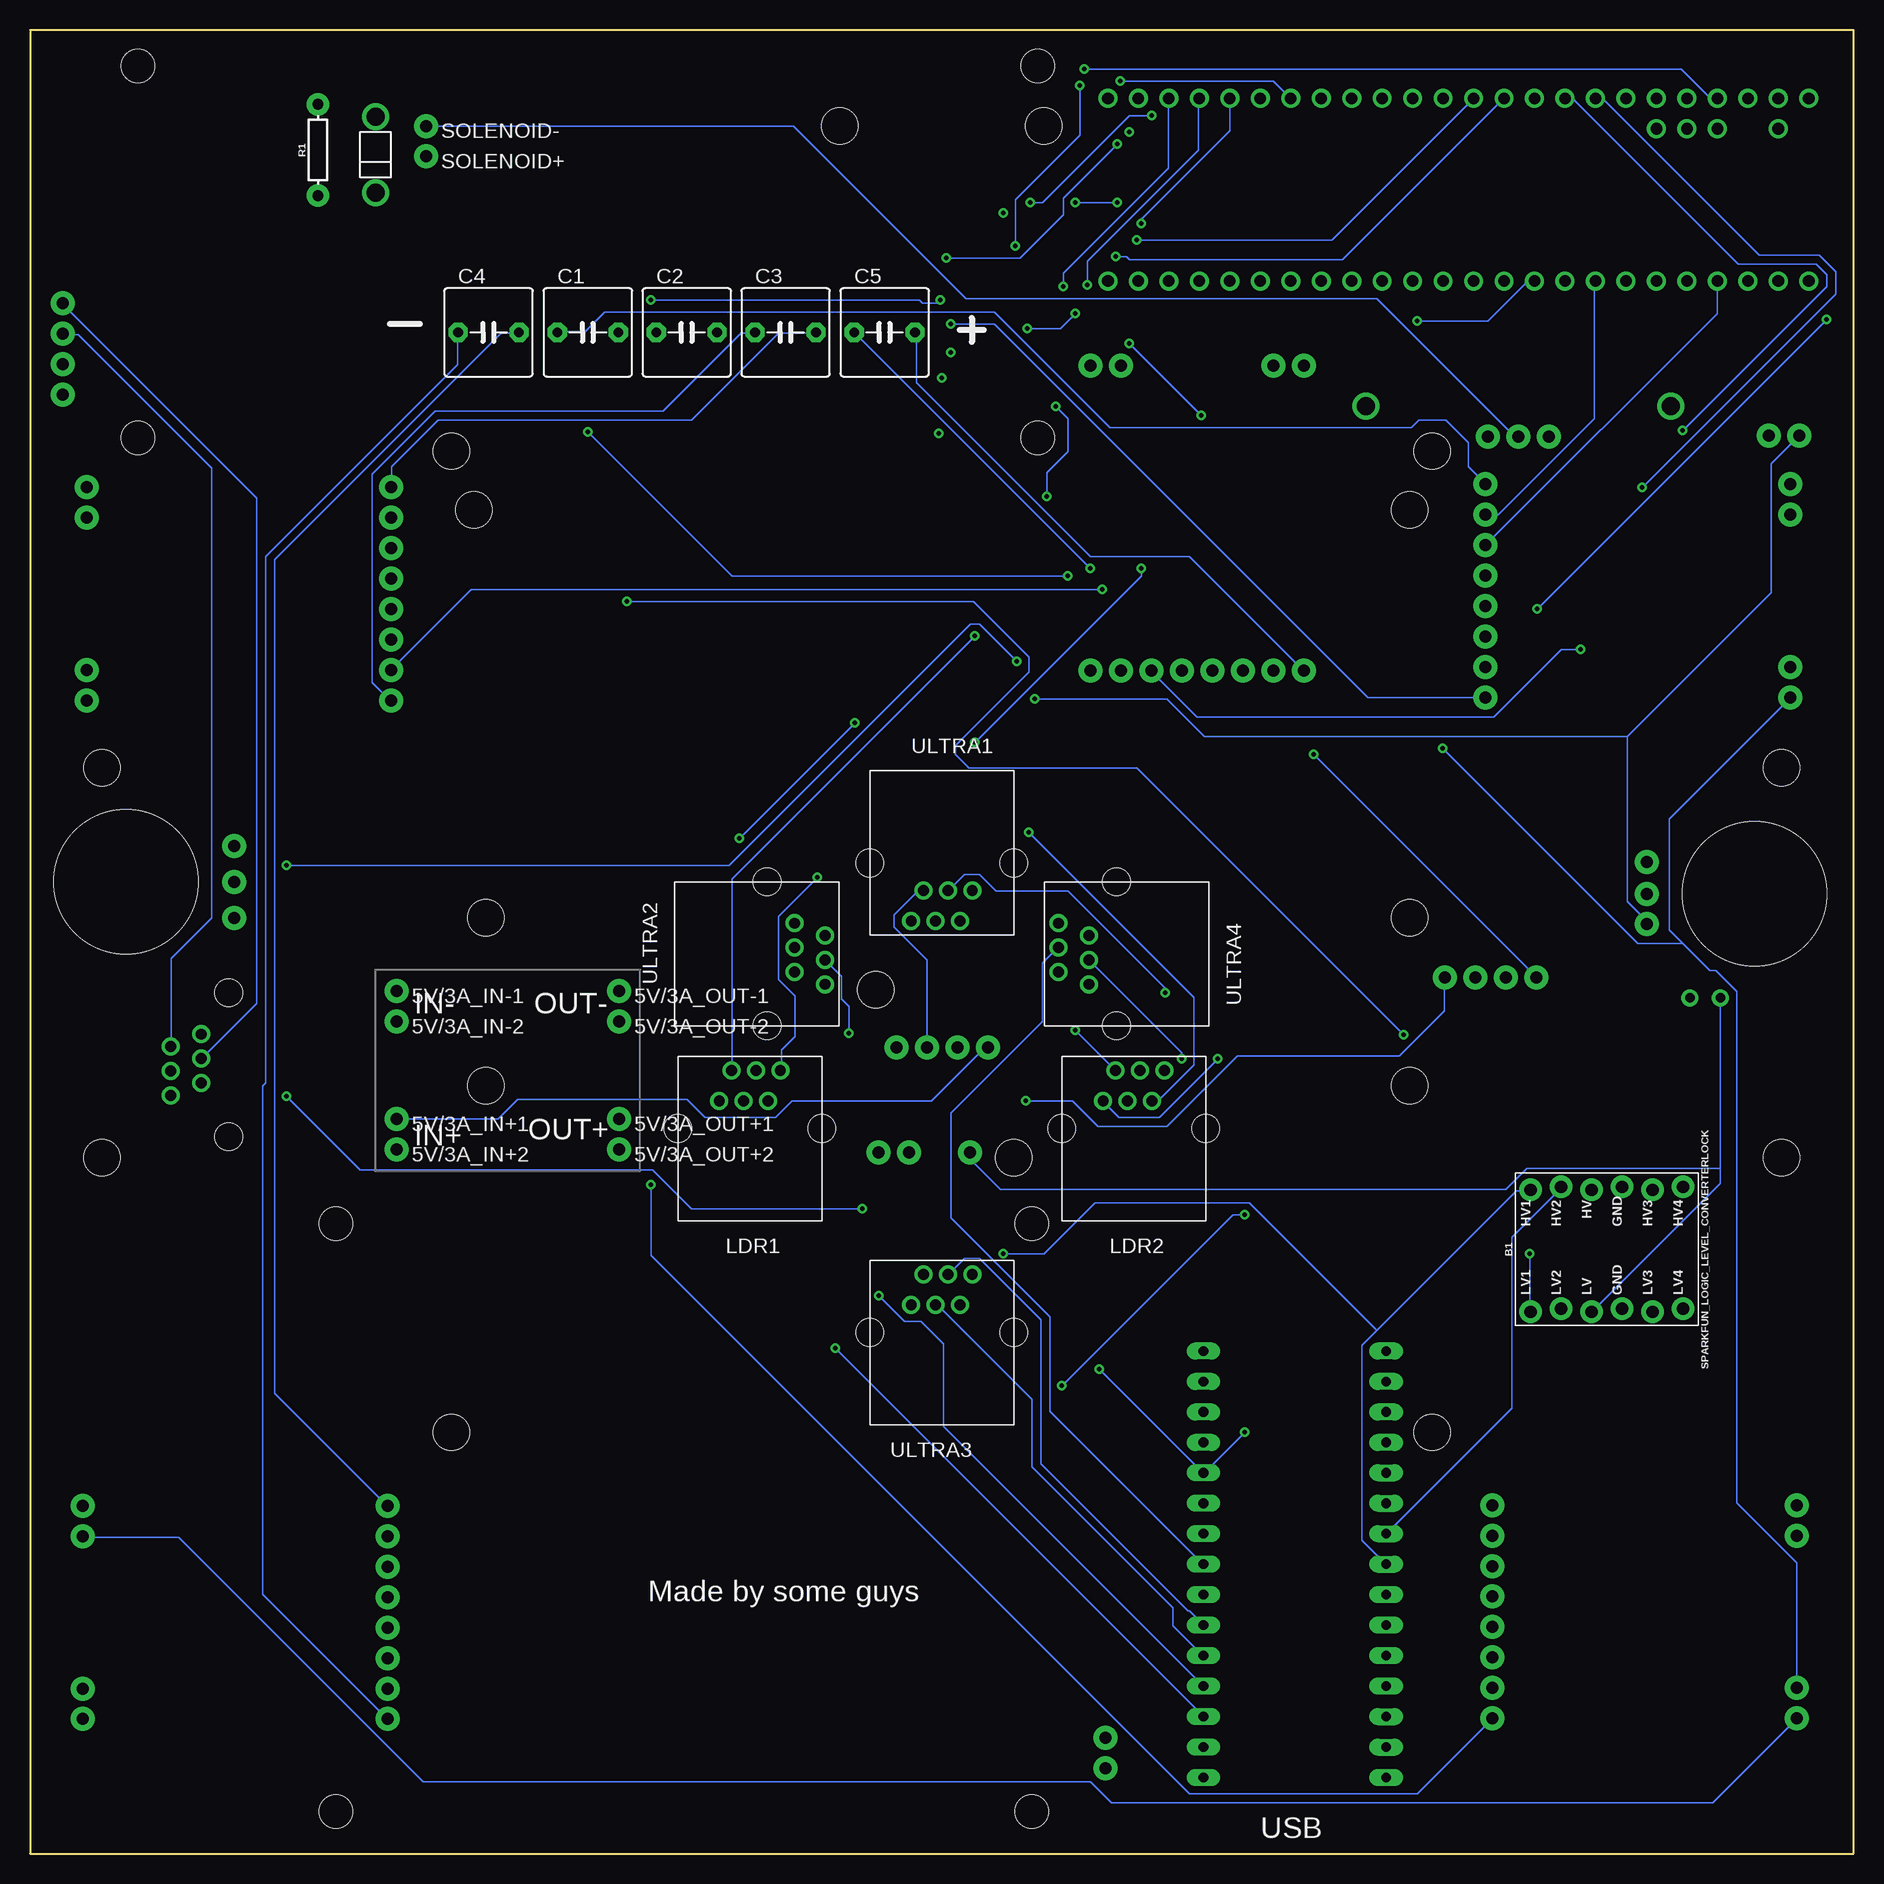
[diagram p4: board, bottom side, seen from below]

Size 152 x 152 mm. Coordinates in mm from the lower left corner, seen from the top.
Outline: 0,152 152,152 152,0 0,0 0,152
Copper layers (1+2*3+16): Top 0.035mm / dielectric 0.486mm / Route2 0.035mm / dielectric 0.487mm / Route3 0.035mm / dielectric 0.486mm / Bottom 0.035mm
Design rules "default *": minimum track width 5mil, minimum drill 0.35mm, track to track 20mil, track to pad 20mil, pad to pad 20mil, via to via 20mil, smd to smd 20mil, copper to edge 40mil, drill to drill 10mil, minimum pad ring 12mil, minimum via ring 8mil, stop-mask expansion 4mil, vias tented up to drill 25mil, thermal gap 10mil
Holes 12 mm at 8.25,80 144,81
Holes 3 mm at 81.5,72 70,58 114,78 115,112 37,112 37,78 67.5,144 84.5,144 35.12,35.11 35.12,116.89 116.88,116.89 116.88,35.11 6,58 146,90.5 6,90.5 146,58 37,64 114,64

### Footprints (pad centres in the part's own frame; a part is rotated, then mirrored left to right if it is on the bottom)
SUPERIORSIM = drill 1 pad 2: . 0,0
SPARKFUN_LOGIC_LEVEL_CONVERTER_LOCK = drill 1.016 pad 1.88: GND1 -4.953,-1.27; GND2 5.207,-1.27; HV 4.953,1.27; HV1 4.953,6.35; HV2 5.207,3.81; HV3 4.953,-3.81; HV4 5.207,-6.35; LV -5.207,1.27; LV1 -5.207,6.35; LV2 -4.953,3.81; LV3 -5.207,-3.81; LV4 -4.953,-6.35
C5B7.2 = drill 0.813 pad 1.6 octagon: 1 -2.54,0; 2 2.54,0
6P6C_FEMALE = drill 0.9 pad 1.3: 1 -1.53,1.27; 2 0.51,1.27; 3 2.55,1.27; 4 -2.55,-1.27; 5 -0.51,-1.27; 6 1.53,-1.27 | hole 2.3: -6,3.57; 6,3.57
LED_3MM-NS = drill 0.813: A -1.27,0; K 1.27,0
LCD-16X2 = hole 2.8: -37.5,15.5; -37.5,-15.5; 37.5,15.5; 37.5,-15.5
1,5 = drill 1.5: P$1 0,0
RPI3 = hole 2.75: 3.5,3.5; 61.5,3.5; 3.5,52.5; 61.5,52.5
AXIAL-0.3 = drill 0.9 pad 1.88: P$1 -3.81,0; P$2 3.81,0
TEENSY_3.5/3.6_BASIC = drill 0.965: 0/RX -25.4,-7.62; 1/TX -22.86,-7.62; 2 -20.32,-7.62; 3/CANTX -17.78,-7.62; 3V3 7.62,-7.62; 3V3_LO -22.86,7.62; 4/CANRX -15.24,-7.62; 5 -12.7,-7.62; 6 -10.16,-7.62; 7 -7.62,-7.62; 8 -5.08,-7.62; 9/CS -2.54,-7.62; 10/CS 0,-7.62; 11/MOSI 2.54,-7.62; 12/MISO 5.08,-7.62; 13/SCK 5.08,7.62; 14/A0 2.54,7.62; 15/A1 0,7.62; 16/A2 -2.54,7.62; 17/A3 -5.08,7.62; 18/A4/SDA -7.62,7.62; 19/A5/SCL -10.16,7.62; 20/A6 -12.7,7.62; 21/A7 -15.24,7.62; 21/DAC0 12.7,7.62; 22/A8 -17.78,7.62; 23/A9 -20.32,7.62; 24 10.16,-7.62; 25 12.7,-7.62; 26 15.24,-7.62; 27 17.78,-7.62; 28 20.32,-7.62; 29 22.86,-7.62; 30 25.4,-7.62; 31/A12 27.94,-7.62; 32/A13 30.48,-7.62; 33/A14 30.48,7.62; 34/A15 27.94,7.62; 35/A16 25.4,7.62; 36/A17 22.86,7.62; 37/A18 20.32,7.62; 38/A19 17.78,7.62; 39/A20 15.24,7.62; A10 -17.78,5.08; A11 -15.24,5.08; A22/DAC1 10.16,7.62; AGND -25.4,7.62; AREF -20.32,5.08; GND -27.94,-7.62; GND2 7.62,7.62; VIN -27.94,7.62; VUSB -25.4,5.08
NANO = drill 0.8 long: 3.3V -10.16,24.13; 5V -10.16,-1.27; A0 -10.16,19.05; A1 -10.16,16.51; A2 -10.16,13.97; A3 -10.16,11.43; A4 -10.16,8.89; A5 -10.16,6.35; A6 -10.16,3.81; A7 -10.16,1.27; AREF -10.16,21.59; D2 5.08,1.27; D3 5.08,3.81; D4 5.08,6.35; D5 5.08,8.89; D6 5.08,11.43; D7 5.08,13.97; D8 5.08,16.51; D9 5.08,19.05; D10 5.08,21.59; D11 5.08,24.13; D12 5.08,26.67; D13 -10.16,26.67; GND -10.16,-6.35; GND1 5.08,-1.27; RAW -10.16,-8.89; RST -10.16,-3.81; RST1 5.08,-3.81; RX1 5.08,-6.35; TX0 5.08,-8.89

### Placement (x,y rotation side)
3V3_RPI  73.66,58.42 90 top
3V3OUT1  30.68,98.91 180 top
3V3OUT2  30.12,13.8 180 top
3V3OUT3  121.88,111.36 0 top
3V3OUT4  122.2,26.45 0 top
3V3OUT5  48.37,98.61 270 top
5V/3A_IN+1  121.45,61.22 0 bottom
5V/3A_IN+2  121.45,58.68 0 bottom
5V/3A_IN-1  121.45,71.88 0 bottom
5V/3A_IN-2  121.45,69.34 0 bottom
5V/3A_OUT+1  102.91,61.22 0 bottom
5V/3A_OUT+2  102.91,58.68 0 bottom
5V/3A_OUT-1  102.91,71.88 0 bottom
5V/3A_OUT-2  102.91,69.34 0 bottom
B1  20.56,50.37 90 bottom
BOOSTER_+12V  34.06,73.02 90 top
BOOSTER_+24V  26.44,73.02 90 top
BOOSTER_-12V  31.52,73.02 90 top
BOOSTER_-24V  28.98,73.02 90 top
C1  105.5,126.8 0 bottom
C2  97.26,126.8 0 bottom
C3  89.02,126.8 0 bottom
C4  113.78,126.8 0 bottom
C5  80.76,126.8 0 bottom
COMPASS  139,65.75 90 top
CS1  30.68,101.45 180 top
CS2  30.12,16.34 180 top
CS3  121.88,108.82 0 top
CS4  122.2,23.91 0 top
CS5  50.91,98.61 270 top
D2  12.36,71.33 0 top
DRIBBLER_+12V1  48.37,124.01 270 top
DRIBBLER_+12V2  45.83,124.01 270 top
DRIBBLER_-12V1  63.61,124.01 270 top
DRIBBLER_-12V2  61.07,124.01 270 top
DRIBBLER_CAP+  45.83,98.61 270 top
DRIBBLER_CAP-  63.61,98.61 270 top
DRIBBLER_DIR  61.07,98.61 270 top
DRIBBLER_PWM  58.53,98.61 270 top
DRIBBLER_SLP  55.99,98.61 270 top
DRIVER_+12V1_1  5.28,98.91 180 top
DRIVER_+12V1_2  5.28,96.37 0 top
DRIVER_+12V2_1  4.72,13.8 180 top
DRIVER_+12V2_2  4.72,11.26 0 top
DRIVER_+12V3_1  147.28,111.36 0 top
DRIVER_+12V3_2  147.28,113.9 180 top
DRIVER_+12V4_1  147.6,26.45 0 top
DRIVER_+12V4_2  147.6,28.99 180 top
DRIVER_-12V1_1  5.28,114.15 180 top
DRIVER_-12V1_2  5.28,111.61 0 top
DRIVER_-12V2_1  4.72,29.04 180 top
DRIVER_-12V2_2  4.72,26.5 0 top
DRIVER_-12V3_1  147.28,96.12 0 top
DRIVER_-12V3_2  147.28,98.66 180 top
DRIVER_-12V4_1  147.6,11.21 0 top
DRIVER_-12V4_2  147.6,13.75 180 top
DRIVER_CAP+1  30.68,96.37 180 top
DRIVER_CAP+2  30.12,11.26 180 top
DRIVER_CAP+3  121.88,113.9 0 top
DRIVER_CAP+4  122.2,28.99 0 top
DRIVER_CAP-1  30.68,114.15 180 top
DRIVER_CAP-2  30.12,29.04 180 top
DRIVER_CAP-3  121.88,96.12 0 top
DRIVER_CAP-4  122.2,11.21 0 top
DRIVER_DIR1  30.68,111.61 180 top
DRIVER_DIR2  30.12,26.5 180 top
DRIVER_DIR3  121.88,98.66 0 top
DRIVER_DIR4  122.2,13.75 0 top
DRIVER_PWM1  30.68,109.07 180 top
DRIVER_PWM2  30.12,23.96 180 top
DRIVER_PWM3  121.88,101.2 0 top
DRIVER_PWM4  122.2,16.29 0 top
DRIVER_SLP1  30.68,106.53 180 top
DRIVER_SLP2  30.12,21.42 180 top
DRIVER_SLP3  121.88,103.74 0 top
DRIVER_SLP4  122.2,18.83 0 top
FLT1  30.68,103.99 180 top
FLT2  30.12,18.88 180 top
FLT3  121.88,106.28 0 top
FLT4  122.2,21.37 0 top
FLT5  53.45,98.61 270 top
LCD1  105.5,133.5 180 top
LCD_GND1  149.28,121.6 0 top
LCD_SCL1  149.28,129.22 0 top
LCD_SDA1  149.28,126.68 0 top
LCD_VCC1  149.28,124.14 0 top
LDR1  92,64 180 bottom
LDR2  60,64 180 bottom
LDR_5V+  77.22,67.18 90 top
LDR_5V-  79.76,67.18 90 top
LED_12V+  72.14,67.18 90 top
LED_12V-  74.68,67.18 90 top
MOSFET_DRAIN  27.94,118.11 270 top
MOSFET_GATE  25.4,118.11 270 top
MOSFET_SOURCE  30.48,118.11 270 top
PAD1  15.24,120.65 0 top
PAD2  40.64,120.65 0 top
PAD3  123.19,138.43 0 top
PAD4  123.19,144.78 0 top
PCB1  65,0 0 top
R1  128,142 90 bottom
RX_PI  81.28,58.42 0 top
SOLENOID+  119,141.46 0 bottom
SOLENOID-  119,144 0 bottom
SUPPLY_+  4.52,118.18 90 top
SUPPLY_-  7.06,118.18 90 top
SWITCH_+1  17.25,77.46 0 top
SWITCH_+2  135,78 180 top
SWITCH_-1  17.25,82.64 0 top
SWITCH_-2  135,84 180 top
SWITCH_ACC1  17.25,80 0 top
SWITCH_ACC2  135,81 180 top
TX_PI  78.74,58.42 0 top
U$1  31.67,138.69 0 top
U$2  49.11,33 180 bottom
ULTRA1  76,79 0 bottom
ULTRA2  87,75 90 bottom
ULTRA3  76,47 180 bottom
ULTRA4  65,75 270 bottom
USB+  62.37,7.09 180 top
USB-  62.37,9.63 180 top

### Tracks (layer width: path | path; a pad name or v marks a point on that pad's centre or on a via)
3.3SCL  (via drill 0.35)
  Top 0.127: v17.62,113.88 21.75,109.75 21.75,81.38 24,79.12 24,61.38 29.25,56.12 29.25,50.38 24.38,45.5 B1.LV2
  Bottom 0.127: v17.62,113.88 1.5,130 1.5,131.88 2.88,133.25 7.88,133.25 20.88,146.25 21.5,146.25 U$1.19/A5/SCL
3.3SDA  (via drill 0.35)
  Top 0.127: v14.25,118.62 16.62,116.25 16.62,85.5 23.25,78.88 23.25,61.12 28.5,55.88 28.5,51.5 v27,50
  Bottom 0.127: v14.25,118.62 2.25,130.62 2.25,131.62 3.12,132.5 9.62,132.5 23.38,146.25 24,146.25 U$1.18/A4/SDA | v27,50 27,45.25 B1.LV1
5VSCL
  Top 0.127: U$2.A5 39,26.62 51,14.62 51,7 53,5 66.5,5 71.12,9.62 133.12,9.62 133.12,61.75 137.62,66.25 COMPASS.2
  Bottom 0.127: U$2.A5 38.88,26.75 28.5,37.12 28.5,51.38 24.38,55.5 B1.HV2 | COMPASS.2 137.62,66.38 133.12,70.88 133.12,113 149.25,129.12 LCD_SCL1..
5VSDA  (via drill 0.35)
  Top 0.127: v70.88,50 74.62,53.75 v82.62,53.75 | v130.62,63.12 137.25,69.75 140.25,69.75 140.25,67.38 COMPASS.6
  Bottom 0.127: 39.75,43.62 28.12,55.25 27,55.25 B1.HV1 | 39.75,43.62 41,42.38 41,26.12 39,24.12 U$2.A4 | COMPASS.6 140.25,67.38 140.25,74.62 136.88,78 136.88,115.5 148,126.62 149.25,126.62 LCD_SDA1.. | 39.75,43.62 50.38,54.25 63.25,54.25 67.5,50 v70.88,50 | v82.62,53.75 96.88,53.75 100.12,57 124.5,57 v130.62,63.12
+3V3
  Bottom 0.127: 11.12,57.12 11.12,55.88 21.75,45.25 B1.LV | 11.12,57.12 11.12,71.25 D2.A | 11.12,57.12 27.25,57.12 29,55.38 71.12,55.38 73.62,57.88 73.62,58.38 3V3_RPI..
+5V
  Bottom 0.127: LDR_5V+.. 77.25,67.25 77.25,74.5 80,77.25 80,78.25 78,80.25 77.62,80.25 ULTRA1.1
  pour Route3 (isolate 0.012, rank 3, no thermals): 0,152 152,152 152,0 0,0
+12V  (via drill 0.35)
  Bottom 0.127: LED_12V+.. 72.25,67.12 72.5,67.12 76.88,62.75 88.5,62.75 89.88,61.38 95.75,61.38 97.25,62.88 111.38,62.88 113,61.25 121.38,61.25 5V/3A_IN+1.. | v69,62.75 65.12,62.75 63,60.62 57.25,60.62 51.38,66.5 37.88,66.5 34.12,70.25 34.12,73 BOOSTER_+12V..
  pour Route3 (isolate 0.012, rank 2, no thermals): 27,70 40,70 40,85 15,85 15,70
  pour Route3 (isolate 0.012, no thermals): 69,71 69,62 78,62 78,71
  pour Route3 (isolate 0.012, no thermals): 117,65 117,56 126,56 126,65
+24V  (via drill 0.35)
  Top 0.127: v45,91.62 60.12,91.62 65.5,97 v65.5,106.5 | v105.5,118.5 123.12,136.12 123.12,138.38 PAD3.P$1
  Bottom 0.127: v45,91.62 26.5,73.12 BOOSTER_+24V.. | v65.5,106.5 93.5,106.5 v105.5,118.5
  pour Route3 (isolate 0.012, no thermals): 21,76 21,67 30,67 30,76
  pour Route3 (isolate 0.012, no thermals): 117,144 117,135 126,135 126,144
BATT+  (via drill 0.35)
  Top 0.127: v130.62,82.38 SWITCH_+2.. | v69.75,99.38 68.25,97.88 v68.25,96.25
  Bottom 0.127: SWITCH_+1.. 17.25,77.75 18.88,79.38 18.88,93.12 | 18.88,93.12 6.88,105.12 6.88,115.88 4.62,118.12 SUPPLY_+.. | v130.62,82.38 93.75,82.38 73.62,102.5 72.88,102.5 v69.75,99.38 | v68.25,96.25 57.25,96.25 54.12,93.12 18.88,93.12
  pour Route3 (isolate 0.012, rank 2, no thermals): 128,83 128,74 137,74 137,83
  pour Route3 (isolate 0.012, no thermals): 2,116 12,116 12,126 2,126
DRIVER+  (via drill 0.35)
  Top 0.127: 136.62,82.62 137.25,83.25 137.25,101.25 147.25,111.25 DRIVER_+12V3_1.. | 136.62,82.62 SWITCH_ACC2.. | 136.62,82.62 136.62,78.25 141.62,73.25 141.62,34.88 147.5,29 DRIVER_+12V4_2.. | v34.25,92.12 42.38,100.25 42.38,120.62 45.75,124 DRIBBLER_+12V2..
  Bottom 0.127: 14.25,75.88 15.38,77 15.38,86.25 5.38,96.25 DRIVER_+12V1_2.. | 14.25,75.88 12,73.62 11.5,73.62 9.75,71.88 9.75,29.25 4.75,24.25 4.75,13.88 DRIVER_+12V2_1.. | v34.25,92.12 18,75.88 14.25,75.88 | DRIVER_+12V4_1.. 147.5,26.38 139.62,26.38 119.25,6 63.62,6 61.88,4.25 11.75,4.25 4.75,11.25 DRIVER_+12V2_2..
  pour Route3 (isolate 0.012, no thermals): 43,126 43,117 52,117 52,126
  pour Route3 (isolate 0.012, no thermals): 3,102 3,93 12,93 12,102
  pour Route3 (isolate 0.012, no thermals): 141,116 141,107 150,107 150,116
  pour Route3 (isolate 0.012, no thermals): 140,32 140,23 149,23 149,32
  pour Route3 (isolate 0.012, no thermals): 1,17 1,8 10,8 10,17
  pour Route3 (isolate 0.012, no thermals): 137,79 128,79 128,86 137,86
GND
  pour Route2 (isolate 0.012, no thermals): 0,152 152,152 152,0 0,0
N$1  (via drill 0.35)
  Top 0.127: v73.25,101.5 73.12,101.62 73.12,132.12 68.62,136.62 63.88,136.62 63.88,146.62 62.75,147.75 v61.12,147.75
  Bottom 0.127: v73.25,101.5 93.5,81.25 93.5,65.38 LDR1.6 | v61.12,147.75 48.38,147.75 47,146.38 U$1.39/A20
N$2  (via drill 0.35)
  Top 0.127: v59.38,107.12 59.38,130.88 59.5,131 U$1.31/A12 | v73.25,92.62 79.75,86.12 79.75,78.5 80,78.25 80,74.25 78.88,73.12 78.88,70.38 81.38,67.88 81.38,61.12 78.75,58.5 TX_PI..
  Bottom 0.127: v59.38,107.12 59.38,106.5 v73.25,92.62
N$3  (via drill 0.35)
  Top 0.127: v76.25,118.38 84.25,110.38 84.25,70.25 82.12,68.12 82.12,59.25 81.38,58.5 RX_PI..
  Route2 0.127: v76.25,118.38 65.25,129.38 63.88,129.38 62.25,131 U$1.32/A13
N$4
  Top 0.127: U$1.9/CS 29.25,131 34.62,125.62 57.62,125.62 57.62,102 61,98.62 DRIBBLER_DIR..
N$5  (via drill 0.35)
  Top 0.127: v36.38,127.75 58.38,127.75 58.38,106.75 59.75,105.38 v62.62,105.38
  Bottom 0.127: v36.38,127.75 30.5,127.75 27.25,131 26.62,131 U$1.8 | v62.62,105.38 115.25,105.38 121.88,98.75 DRIVER_DIR3..
N$6  (via drill 0.35)
  Top 0.127: v92.88,84.62 92.88,66.75 91.5,65.38 LDR1.5 | v83.25,94.25 73.88,103.62 73.88,132.38 v68.62,137.62 | v58.5,144.88 34.25,144.88 34.25,146.25 U$1.14/A0
  Bottom 0.127: v83.25,94.25 v92.88,84.62 | v68.62,137.62 67.62,137.62 60.38,144.88 v58.5,144.88
N$7  (via drill 0.35)
  Top 0.127: v86.38,81.38 85,82.75 85,112.62 75,122.62 75,124.88 v75.25,125.12
  Route3 0.127: v75.25,125.12 65.88,134.5 v59.75,134.5
  Bottom 0.127: v86.38,81.38 89.62,78.12 89.62,72.88 88.25,71.5 88.25,68.12 89.38,67 89.38,65.38 LDR1.4 | v59.75,134.5 43.5,134.5 31.75,146.25 U$1.15/A1
N$8  (via drill 0.35)
  Top 0.127: v76,123 94.88,104.12 94.88,63 94.62,62.75 LDR1.3
  Route3 0.127: v76,123 65.88,133.12 v61.5,133.12
  Bottom 0.127: v61.5,133.12 60.62,133.12 60.38,132.88 42.62,132.88 29.25,146.25 U$1.16/A2
N$9  (via drill 0.35)
  Top 0.127: v70.88,136.75 70.88,136.38 96,111.25 96,62.25 95.88,62.12 95.88,61.38 93.88,61.38 92.62,62.62 LDR1.2 | v60.38,143.5 26.62,143.5 26.62,146.25 U$1.17/A3
  Route2 0.127: v70.88,136.75 66.75,140.88 64.38,140.88 61.75,143.5 v60.38,143.5
N$10  (via drill 0.35)
  Top 0.127: v75.62,133 90.5,133 101.25,122.25 101.25,54.75 98.38,54.75 90.5,62.62 LDR1.1 | v61.38,142.5 19,142.5 19,146.25 U$1.20/A6
  Bottom 0.127: v75.62,133 69.5,133 65.88,136.62 65.88,138 v61.38,142.5
N$11
  Top 0.127: U$1.7 24,131 23.75,130.75 23.75,80.38 24.75,79.38 24.75,61.62 30,56.38 30,31.25 28.5,29.75 28.5,28 30,26.5 DRIVER_DIR2..
N$12
  Top 0.127: SOLENOID-.. 119,144.75 123.12,144.75 PAD4.P$1
  Bottom 0.127: SOLENOID-.. 88.38,144 74,129.62 39.75,129.62 28.25,118.12 28,118.12 MOSFET_DRAIN..
N$14  (via drill 0.35)
  Top 0.127: v64.12,148.75 65.5,148.75 65.5,145.75 64.88,145.12 64.88,142.88 66.38,141.38 117.38,141.38 117.38,144.62 120.38,147.62 129.62,147.62 129.62,23.75 122.25,16.38 DRIVER_PWM4..
  Bottom 0.127: v64.12,148.75 14.38,148.75 12,146.38 11.38,146.38 U$1.23/A9
N$15  (via drill 0.35)
  Top 0.127: v2.25,127.88 2.25,147.75 12.5,147.75 13.88,146.38 U$1.22/A8 | v26.38,103.75 29,101.12 29,95.75 43.25,81.5 43.25,60.75 v50.75,53.25 | v66,39 91.25,13.75 DRIVER_DIR4..
  Bottom 0.127: v26.38,103.75 v2.25,127.88 | v50.75,53.25 51.75,53.25 v66,39
N$16
  Bottom 0.127: C4.2 111.25,126.75 112.75,126.75 131.62,107.88 131.62,38.38 122.25,29 DRIVER_CAP+4..
N$17
  Bottom 0.127: U$1.6 21.62,131 21.62,119.62 29.62,111.62 30.62,111.62 DRIVER_DIR1..
N$18  (via drill 0.35)
  Top 0.127: v68.75,85.12 72.25,88.62 72.25,131.62 v69.88,134 | v64.5,147.38 64.12,147.38 62.75,148.75 49.5,148.75 49.5,146.38 U$1.38/A19
  Bottom 0.127: v68.75,85.12 55,71.38 55,65.75 58,62.75 58.38,62.75 LDR2.1 | v69.88,134 69.88,137.88 64.5,143.25 v64.5,147.38
N$19  (via drill 0.35)
  Top 0.127: v68.88,127.12 70.75,125.25 70.75,97.38 67,93.62 67,83.38 62.38,78.75 62.38,71.88 63.75,70.5 63.75,68.38 64,68.12 64,62.25 63.88,62.12 63.88,61.38 61.88,61.38 60.62,62.62 LDR2.2 | v64.88,128.38 64.88,131.12 60.12,135.88 v59.38,135.88
  Bottom 0.127: v68.88,127.12 66.12,127.12 v64.88,128.38 | v59.38,135.88 59.38,136.25 52,143.62 52,146.25 U$1.37/A18
N$20  (via drill 0.35)
  Top 0.127: v53,66.25 44,75.25 44,109.5 v54.38,119.88 | v60.38,125.88 63.88,129.38 v63.88,130.75
  Bottom 0.127: v53,66.25 57.88,61.38 61.25,61.38 62.5,62.62 LDR2.3 | v60.38,125.88 v54.38,119.88 | v63.88,130.75 63.88,132.75 54.62,142 54.62,146.25 U$1.36/A17
N$21  (via drill 0.35)
  Top 0.127: v65.88,130.62 65.88,128 65.5,127.62 65.5,113.5 66.5,112.5 66.5,97 58.38,88.88 58.38,66.25 57.5,65.38 LDR2.4
  Bottom 0.127: v65.88,130.62 65.88,131.75 57.12,140.5 57.12,146.25 U$1.35/A16
N$22  (via drill 0.35)
  Top 0.127: v67.25,113.12 67.25,96.75 59.12,88.62 59.12,65.62 59.38,65.38 LDR2.5 | v66.5,120.62 66.88,121 66.88,132.12 63.88,135.12 62.38,135.12 62.38,143.5 59.62,146.25 U$1.34/A15
  Bottom 0.127: v67.25,113.12 67.25,115.12 65.5,116.88 65.5,119.62 v66.5,120.62
N$23  (via drill 0.35)
  Top 0.127: v64.88,68.62 67.75,71.5 67.75,93.38 71.5,97.12 71.5,128.5 64.12,135.88 63.12,135.88 63.12,145.38 62.25,146.25 U$1.33/A14
  Bottom 0.127: v64.88,68.62 61.62,65.38 LDR2.6
N$24  (via drill 0.35)
  Top 0.127: v22.75,100.38 22.75,127.25 19,131 U$1.5
  Bottom 0.127: v22.75,100.38 24.38,100.38 30,94.75 54.75,94.75 58.5,98.5 DRIBBLER_PWM..
N$25  (via drill 0.35)
  Top 0.127: v61.38,137.62 23,137.62 16.5,131.12 U$1.4/CANRX | v64.88,137.62 67.5,137.62 67.5,138.12 68.12,138.75 104.5,138.75 104.5,118.12 121.38,101.25 121.88,101.25 DRIVER_PWM3..
  Bottom 0.127: v64.88,137.62 v61.38,137.62
N$26  (via drill 0.35)
  Top 0.127: v57.38,71.75 57.38,69.25 51.75,63.62 51.75,8.75 54.12,6.38 U$2.D12
  Bottom 0.127: v57.38,71.75 57.38,72.12 65.5,80.25 71.5,80.25 72.88,81.62 74.12,81.62 75.38,80.38 ULTRA1.2
N$27
  Bottom 0.127: C4.1 116.38,126.75 116.38,124.12 132.38,108.12 132.38,64.25 132.62,64 132.62,21.62 122.25,11.25 DRIVER_CAP-4..
N$28
  Top 0.127: U$2.D11 54.25,8.88 61.88,16.5 61.88,42.38 75.25,55.75 75.25,61.75 70.5,66.5 70.5,71.62 76.5,77.62 ULTRA1.5
N$29  (via drill 0.35)
  Top 0.127: v84.88,42.12 88.25,45.5 88.25,64.5 88,64.75 88,71.25 89.62,72.88 89.62,74.25 88.38,75.5 ULTRA2.2
  Bottom 0.127: v84.88,42.12 54.25,11.5 U$2.D10
N$30  (via drill 0.35)
  Top 0.127: v81.25,46.5 83.75,49 v83.75,68.38
  Bottom 0.127: v81.25,46.5 79.12,44.38 77.75,44.38 75.88,42.5 75.88,35.62 54.25,14 U$2.D9 | v83.75,68.38 83.75,70.62 84.38,71.25 84.38,73.12 85.62,74.38 ULTRA2.5
N$31
  Bottom 0.127: C3.2 86.5,126.75 89.62,126.75 96.88,119.5 118,119.5 121.88,115.62 121.88,114 DRIVER_CAP+3..
N$32
  Bottom 0.127: C3.1 91.62,126.75 92.75,126.75 99.25,120.25 118.25,120.25 123.5,115 123.5,97.62 122,96.12 DRIVER_CAP-3..
N$33  (via drill 0.35)
  Top 0.127: v100.25,55.75 100.25,121.25 94.75,126.75 C2.2
  Bottom 0.127: v100.25,55.75 100.25,49.88 55.38,5 36.38,5 DRIVER_CAP+2..
N$34  (via drill 0.35)
  Top 0.127: v102.25,104.38 102.25,124.38 99.88,126.75 C2.1 | v37.5,68.25 30.75,61.5 30.75,29.75 30.12,29.12 DRIVER_CAP-2..
  Bottom 0.127: v102.25,104.38 73.38,104.38 68.75,99.75 68.75,98.5 74.88,92.38 74.88,91.62 73.75,90.5 59.75,90.5 v37.5,68.25
N$35  (via drill 0.35)
  Top 0.127: v100.25,129.5 102.88,126.88 C1.2 | v76.12,129.5 75.25,128.62 v75.25,127.5
  Bottom 0.127: v100.25,129.5 77.88,129.5 77.62,129.25 76.38,129.25 v76.12,129.5 | v75.25,127.5 71.62,127.5 40.5,96.38 30.75,96.38 DRIVER_CAP+1..
N$36
  Bottom 0.127: C1.1 108,126.88 105.75,126.88 104.12,128.5 71.62,128.5 62,118.88 36.88,118.88 36.25,119.5 34,119.5 32.12,117.62 32.12,115.62 30.75,114.25 DRIVER_CAP-1..
N$37  (via drill 0.35)
  Top 0.127: v63.62,107.12 63.62,98.62 DRIBBLER_CAP-..
  Bottom 0.127: v63.62,107.12 C5.1
N$38
  Bottom 0.127: C5.2 78.12,126.75 78.12,122.62 63.62,108.12 55.38,108.12 45.88,98.62 DRIBBLER_CAP+..
N$39
  Bottom 0.127: U$2.D8 54.25,16.5 56.75,19 56.75,20.5 68.5,32.25 68.5,37.88 76.25,45.62 76.5,45.62 ULTRA3.2
N$40
  Bottom 0.127: U$2.D7 54.25,19.12 55.38,20.25 55.5,20.25 67.75,32.5 67.75,44.5 72.88,49.62 74.12,49.62 75.38,48.38 ULTRA3.5
N$41  (via drill 0.35)
  Top 0.127: v56,66.25 56,64.75 56.25,64.5 56.25,23.62 54.25,21.62 U$2.D6
  Bottom 0.127: v56,66.25 56,66.75 63.62,74.38 ULTRA4.2
N$42
  Bottom 0.127: U$2.D5 54.25,24.12 67,36.88 67,44.75 75.25,53 75.25,61.75 67.62,69.38 67.62,74.25 66.38,75.5 ULTRA4.5
N$43
  Top 0.127: U$1.3/CANTX 13.88,131 13.25,130.38 13.25,85.12 15.38,83 15.38,58.88 12.62,56.12 12.62,41.38 30,24 DRIVER_PWM2..
N$44
  Bottom 0.127: DRIVER_PWM1.. 11.38,128.38 11.38,131 U$1.2
N$45  (via drill 0.35)
  Top 0.127: v50.75,35.12 39.62,46.25 39.62,84.12 25.38,98.38 25.38,118 MOSFET_GATE.. | v62.88,40.38 89.62,40.38 107,57.75 107,60.75 125,78.75 125,142.75 128,145.75 R1.P$2
  Bottom 0.127: v50.75,35.12 54.12,31.75 U$2.D2 54.25,31.75 v62.88,40.38

### Text on the board
tPlace: ON MOTOR | ON ALL | BATTERY
bPlace: OUT- | IN- | OUT+ | IN+ | Made by some guys | USB
tDocu: DRIBBLER | DRIVER1 | DRIVER3 | DRIVER2 | DRIVER4